# EAGLE schematic 010 (EAGLE 9.6.2)

## Sheet 1 of 4
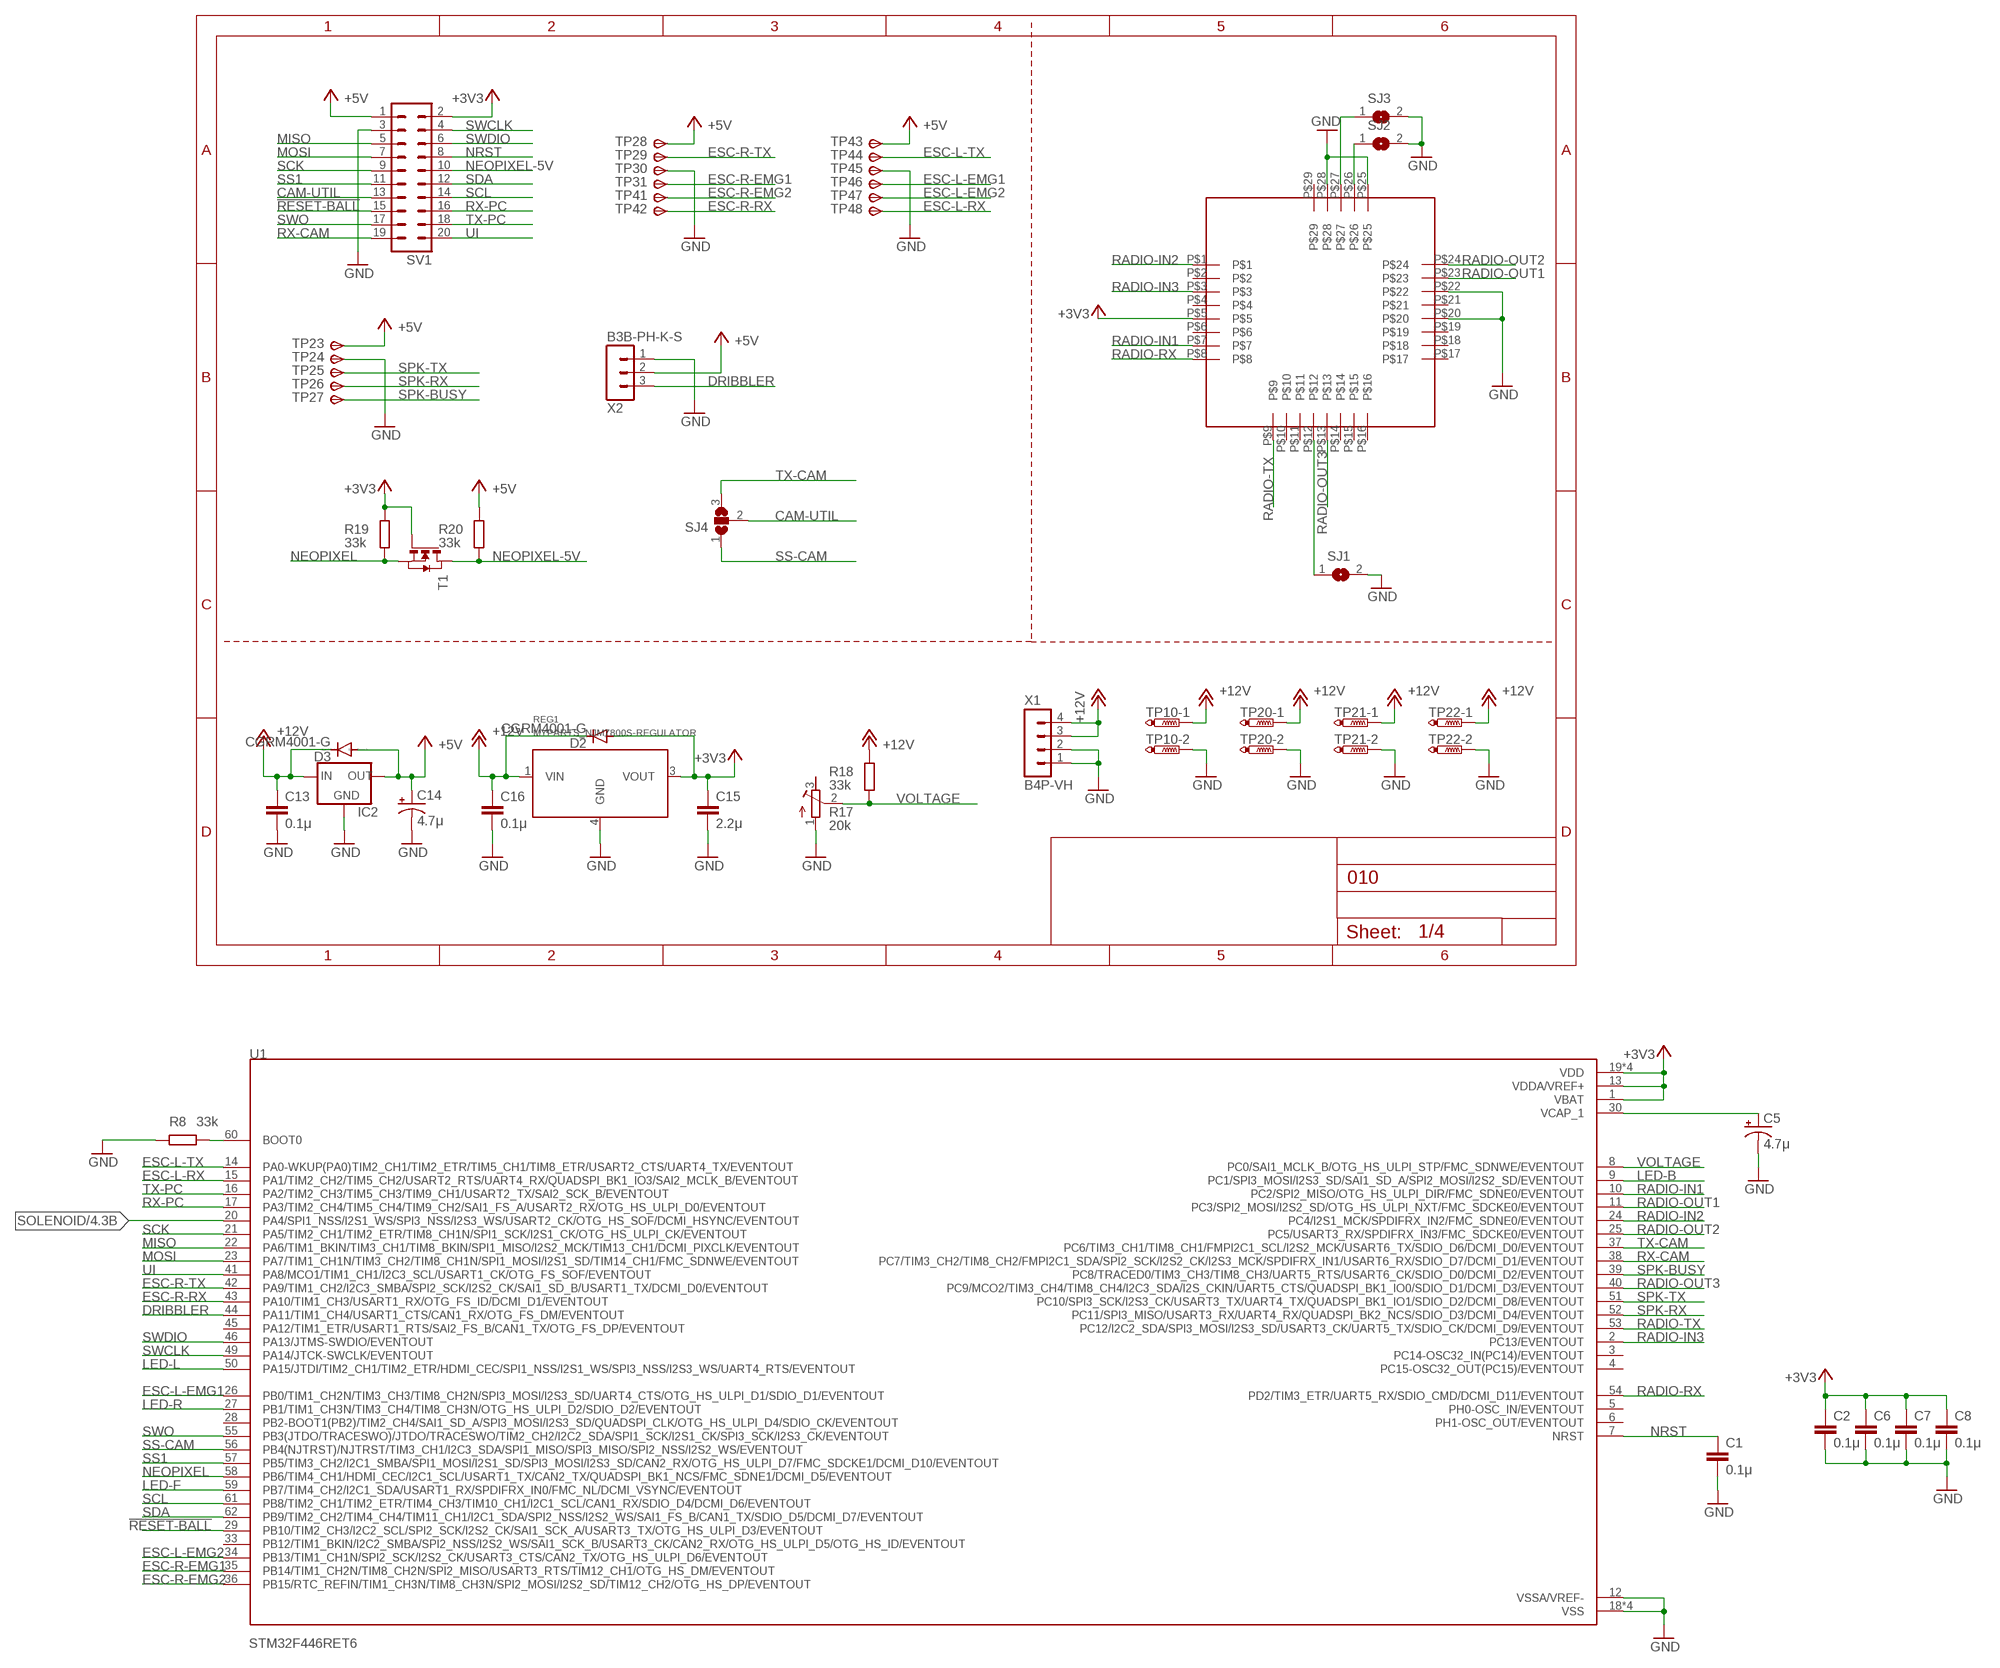
[diagram p0: schematic, sheet 1]

### Parts
C1  0.1μ  C-EUC1608  [C1608]
C2  0.1μ  C-EUC1608  [C1608]
C5  4.7μ  CPOL-USSANYO_SMD_B6  [SANYO-OSCON_SMD_B6]
C6  0.1μ  C-EUC1608  [C1608]
C7  0.1μ  C-EUC1608  [C1608]
C8  0.1μ  C-EUC1608  [C1608]
C13  0.1μ  C-EUC1608  [C1608]
C14  4.7μ  CPOL-USSANYO_SMD_B6  [SANYO-OSCON_SMD_B6]
C15  2.2μ  C-EUC1608  [C1608]
C16  0.1μ  C-EUC1608  [C1608]
D2  CGRM4001-G  [SOD-123_MINI-SMA]
D3  CGRM4001-G  [SOD-123_MINI-SMA]
IC2  78XXS  [78XXS]
R8  33k  R-EU_R0603  [R0603]
R17  20k  R-TRIMM3296W  [RTRIM3296W]
R18  33k  R-EU_R0603  [R0603]
R19  33k  R-EU_R0603  [R0603]
R20  33k  R-EU_R0603  [R0603]
REG1  MYPARTS_NJM7800S-REGULATOR  [MYPARTS_D-PAK_TO252AA]
SJ1  SJ  [SJ]
SJ2  SJ  [SJ]
SJ3  SJ  [SJ]
SJ4  SJ2W  [SJ_2]
SV1  ML20  [ML20]
T1  NMOSSOT23  [SOT-23]
TP10  PTR2  [P2-38-17]
TP20  PTR2  [P2-38-17]
TP21  PTR2  [P2-38-17]
TP22  PTR2  [P2-38-17]
TP23  TPSTP09SQ  [TP09SQ]
TP24  TPSTP09R  [TP09R]
TP25  TPSTP09R  [TP09R]
TP26  TPSTP09R  [TP09R]
TP27  TPSTP09R  [TP09R]
TP28  TPSTP09SQ  [TP09SQ]
TP29  TPSTP09R  [TP09R]
TP30  TPSTP09R  [TP09R]
TP31  TPSTP09R  [TP09R]
TP41  TPSTP09R  [TP09R]
TP42  TPSTP09R  [TP09R]
TP43  TPSTP09SQ  [TP09SQ]
TP44  TPSTP09R  [TP09R]
TP45  TPSTP09R  [TP09R]
TP46  TPSTP09R  [TP09R]
TP47  TPSTP09R  [TP09R]
TP48  TPSTP09R  [TP09R]
U1  STM32F446RET6  [QFP50P1200X1200X160-64N]
U$1  LITE  [LITE]
X1  B4P-VH  [B4P-VH]
X2  B3B-PH-K-S  [B3B-PH-K-S]

### Nets
!RESET-BALL: SV1.15 U1.29(PB10/TIM2_CH3/I2C2_SCL/SPI2_SCK/I2S2_CK/SAI1_SCK_A/USART3_TX/OTG_HS_ULPI_D3/EVENTOUT)
+3V3: C2.1 C6.1 C7.1 C8.1 C15.1 D2.A R19.2 REG1.3(VOUT) SV1.2 T1.3(G) U1.1(VBAT) U1.13(VDDA/VREF+) U1.19(VDD) U1.32(VDD) U1.48(VDD) U1.64(VDD) U$1.P$5 ; also sheet 2,3
+5V: C14.+ D3.A IC2.OUT R20.2 SV1.1 TP23.TP(PP) TP28.TP(PP) TP43.TP(PP) X2.2 ; also sheet 2,3
+12V: C13.1 C16.1 D2.C D3.C IC2.IN R18.2 REG1.1(VIN) TP10.TP-1 TP20.TP-1 TP21.TP-1 TP22.TP-1 X1.3 X1.4 ; also sheet 4
CAM-UTIL: SJ4.2 SV1.13
DRIBBLER: U1.44(PA11/TIM1_CH4/USART1_CTS/CAN1_RX/OTG_FS_DM/EVENTOUT) X2.3
ESC-L-EMG1: TP46.TP(PP) U1.26(PB0/TIM1_CH2N/TIM3_CH3/TIM8_CH2N/SPI3_MOSI/I2S3_SD/UART4_CTS/OTG_HS_ULPI_D1/SDIO_D1/EVENTOUT)
ESC-L-EMG2: TP47.TP(PP) U1.34(PB13/TIM1_CH1N/SPI2_SCK/I2S2_CK/USART3_CTS/CAN2_TX/OTG_HS_ULPI_D6/EVENTOUT)
ESC-L-RX: TP48.TP(PP) U1.15(PA1/TIM2_CH2/TIM5_CH2/USART2_RTS/UART4_RX/QUADSPI_BK1_IO3/SAI2_MCLK_B/EVENTOUT)
ESC-L-TX: TP44.TP(PP) U1.14(PA0-WKUP(PA0)TIM2_CH1/TIM2_ETR/TIM5_CH1/TIM8_ETR/USART2_CTS/UART4_TX/EVENTOUT)
ESC-R-EMG1: TP31.TP(PP) U1.35(PB14/TIM1_CH2N/TIM8_CH2N/SPI2_MISO/USART3_RTS/TIM12_CH1/OTG_HS_DM/EVENTOUT)
ESC-R-EMG2: TP41.TP(PP) U1.36(PB15/RTC_REFIN/TIM1_CH3N/TIM8_CH3N/SPI2_MOSI/I2S2_SD/TIM12_CH2/OTG_HS_DP/EVENTOUT)
ESC-R-RX: TP42.TP(PP) U1.43(PA10/TIM1_CH3/USART1_RX/OTG_FS_ID/DCMI_D1/EVENTOUT)
ESC-R-TX: TP29.TP(PP) U1.42(PA9/TIM1_CH2/I2C3_SMBA/SPI2_SCK/I2S2_CK/SAI1_SD_B/USART1_TX/DCMI_D0/EVENTOUT)
GND: C1.2 C2.2 C5.- C6.2 C7.2 C8.2 C13.2 C14.- C15.2 C16.2 IC2.GND R8.2 R17.1(A) REG1.4(GND) SJ1.2 SJ2.2 SJ3.2 SV1.3 TP10.TP-2 TP20.TP-2 TP21.TP-2 TP22.TP-2 TP24.TP(PP) TP30.TP(PP) TP45.TP(PP) U1.12(VSSA/VREF-) U1.18(VSS) U1.31(VSS) U1.47(VSS) U1.63(VSS) U$1.P$20 U$1.P$22 U$1.P$25 U$1.P$28 X1.1 X1.2 X2.1 ; also sheet 2,3,4
LED-B: U1.9(PC1/SPI3_MOSI/I2S3_SD/SAI1_SD_A/SPI2_MOSI/I2S2_SD/EVENTOUT) ; also sheet 3
LED-F: U1.59(PB7/TIM4_CH2/I2C1_SDA/USART1_RX/SPDIFRX_IN0/FMC_NL/DCMI_VSYNC/EVENTOUT) ; also sheet 3
LED-L: U1.50(PA15/JTDI/TIM2_CH1/TIM2_ETR/HDMI_CEC/SPI1_NSS/I2S1_WS/SPI3_NSS/I2S3_WS/UART4_RTS/EVENTOUT) ; also sheet 2
LED-R: U1.27(PB1/TIM1_CH3N/TIM3_CH4/TIM8_CH3N/OTG_HS_ULPI_D2/SDIO_D2/EVENTOUT) ; also sheet 2
MISO: SV1.5 U1.22(PA6/TIM1_BKIN/TIM3_CH1/TIM8_BKIN/SPI1_MISO/I2S2_MCK/TIM13_CH1/DCMI_PIXCLK/EVENTOUT)
MOSI: SV1.7 U1.23(PA7/TIM1_CH1N/TIM3_CH2/TIM8_CH1N/SPI1_MOSI/I2S1_SD/TIM14_CH1/FMC_SDNWE/EVENTOUT)
N$4: R8.1 U1.60(BOOT0)
N$5: C5.+ U1.30(VCAP_1)
N$6: SJ1.1 U$1.P$12
N$7: SJ2.1 U$1.P$26
N$8: SJ3.1 U$1.P$27
NEOPIXEL: R19.1 T1.2(S) U1.58(PB6/TIM4_CH1/HDMI_CEC/I2C1_SCL/USART1_TX/CAN2_TX/QUADSPI_BK1_NCS/FMC_SDNE1/DCMI_D5/EVENTOUT)
NEOPIXEL-5V: R20.1 SV1.10 T1.1(D)
NRST: C1.1 SV1.8 U1.7(NRST)
RADIO-IN1: U1.10(PC2/SPI2_MISO/OTG_HS_ULPI_DIR/FMC_SDNE0/EVENTOUT) U$1.P$7
RADIO-IN2: U1.24(PC4/I2S1_MCK/SPDIFRX_IN2/FMC_SDNE0/EVENTOUT) U$1.P$1
RADIO-IN3: U1.2(PC13/EVENTOUT) U$1.P$3
RADIO-OUT1: U1.11(PC3/SPI2_MOSI/I2S2_SD/OTG_HS_ULPI_NXT/FMC_SDCKE0/EVENTOUT) U$1.P$23
RADIO-OUT2: U1.25(PC5/USART3_RX/SPDIFRX_IN3/FMC_SDCKE0/EVENTOUT) U$1.P$24
RADIO-OUT3: U1.40(PC9/MCO2/TIM3_CH4/TIM8_CH4/I2C3_SDA/I2S_CKIN/UART5_CTS/QUADSPI_BK1_IO0/SDIO_D1/DCMI_D3/EVENTOUT) U$1.P$13
RADIO-RX: U1.54(PD2/TIM3_ETR/UART5_RX/SDIO_CMD/DCMI_D11/EVENTOUT) U$1.P$8
RADIO-TX: U1.53(PC12/I2C2_SDA/SPI3_MOSI/I2S3_SD/USART3_CK/UART5_TX/SDIO_CK/DCMI_D9/EVENTOUT) U$1.P$9
RX-CAM: SV1.19 U1.38(PC7/TIM3_CH2/TIM8_CH2/FMPI2C1_SDA/SPI2_SCK/I2S2_CK/I2S3_MCK/SPDIFRX_IN1/USART6_RX/SDIO_D7/DCMI_D1/EVENTOUT)
RX-PC: SV1.16 U1.17(PA3/TIM2_CH4/TIM5_CH4/TIM9_CH2/SAI1_FS_A/USART2_RX/OTG_HS_ULPI_D0/EVENTOUT)
SCK: SV1.9 U1.21(PA5/TIM2_CH1/TIM2_ETR/TIM8_CH1N/SPI1_SCK/I2S1_CK/OTG_HS_ULPI_CK/EVENTOUT)
SCL: SV1.14 U1.61(PB8/TIM2_CH1/TIM2_ETR/TIM4_CH3/TIM10_CH1/I2C1_SCL/CAN1_RX/SDIO_D4/DCMI_D6/EVENTOUT) ; also sheet 2,3
SDA: SV1.12 U1.62(PB9/TIM2_CH2/TIM4_CH4/TIM11_CH1/I2C1_SDA/SPI2_NSS/I2S2_WS/SAI1_FS_B/CAN1_TX/SDIO_D5/DCMI_D7/EVENTOUT) ; also sheet 2,3
SOLENOID: U1.20(PA4/SPI1_NSS/I2S1_WS/SPI3_NSS/I2S3_WS/USART2_CK/OTG_HS_SOF/DCMI_HSYNC/EVENTOUT) ; also sheet 4
SPK-BUSY: TP27.TP(PP) U1.39(PC8/TRACED0/TIM3_CH3/TIM8_CH3/UART5_RTS/USART6_CK/SDIO_D0/DCMI_D2/EVENTOUT)
SPK-RX: TP26.TP(PP) U1.52(PC11/SPI3_MISO/USART3_RX/UART4_RX/QUADSPI_BK2_NCS/SDIO_D3/DCMI_D4/EVENTOUT)
SPK-TX: TP25.TP(PP) U1.51(PC10/SPI3_SCK/I2S3_CK/USART3_TX/UART4_TX/QUADSPI_BK1_IO1/SDIO_D2/DCMI_D8/EVENTOUT)
SS1: SV1.11 U1.57(PB5/TIM3_CH2/I2C1_SMBA/SPI1_MOSI/I2S1_SD/SPI3_MOSI/I2S3_SD/CAN2_RX/OTG_HS_ULPI_D7/FMC_SDCKE1/DCMI_D10/EVENTOUT)
SS-CAM: SJ4.1 U1.56(PB4(NJTRST)/NJTRST/TIM3_CH1/I2C3_SDA/SPI1_MISO/SPI3_MISO/SPI2_NSS/I2S2_WS/EVENTOUT)
SWCLK: SV1.4 U1.49(PA14/JTCK-SWCLK/EVENTOUT)
SWDIO: SV1.6 U1.46(PA13/JTMS-SWDIO/EVENTOUT)
SWO: SV1.17 U1.55(PB3(JTDO/TRACESWO)/JTDO/TRACESWO/TIM2_CH2/I2C2_SDA/SPI1_SCK/I2S1_CK/SPI3_SCK/I2S3_CK/EVENTOUT)
TX-CAM: SJ4.3 U1.37(PC6/TIM3_CH1/TIM8_CH1/FMPI2C1_SCL/I2S2_MCK/USART6_TX/SDIO_D6/DCMI_D0/EVENTOUT)
TX-PC: SV1.18 U1.16(PA2/TIM2_CH3/TIM5_CH3/TIM9_CH1/USART2_TX/SAI2_SCK_B/EVENTOUT)
UI: SV1.20 U1.41(PA8/MCO1/TIM1_CH1/I2C3_SCL/USART1_CK/OTG_FS_SOF/EVENTOUT)
VOLTAGE: R17.2(S) R18.1 U1.8(PC0/SAI1_MCLK_B/OTG_HS_ULPI_STP/FMC_SDNWE/EVENTOUT)
Unconnected: R17.3(E) U1.3(PC14-OSC32_IN(PC14)/EVENTOUT) U1.4(PC15-OSC32_OUT(PC15)/EVENTOUT) U1.5(PH0-OSC_IN/EVENTOUT) U1.6(PH1-OSC_OUT/EVENTOUT) U1.28(PB2-BOOT1(PB2)/TIM2_CH4/SAI1_SD_A/SPI3_MOSI/I2S3_SD/QUADSPI_CLK/OTG_HS_ULPI_D4/SDIO_CK/EVENTOUT) U1.33(PB12/TIM1_BKIN/I2C2_SMBA/SPI2_NSS/I2S2_WS/SAI1_SCK_B/USART3_CK/CAN2_RX/OTG_HS_ULPI_D5/OTG_HS_ID/EVENTOUT) U1.45(PA12/TIM1_ETR/USART1_RTS/SAI2_FS_B/CAN1_TX/OTG_FS_DP/EVENTOUT) U$1.P$2 U$1.P$4 U$1.P$6 U$1.P$10 U$1.P$11 U$1.P$14 U$1.P$15 U$1.P$16 U$1.P$17 U$1.P$18 U$1.P$19 U$1.P$21 U$1.P$29

## Sheet 2 of 4
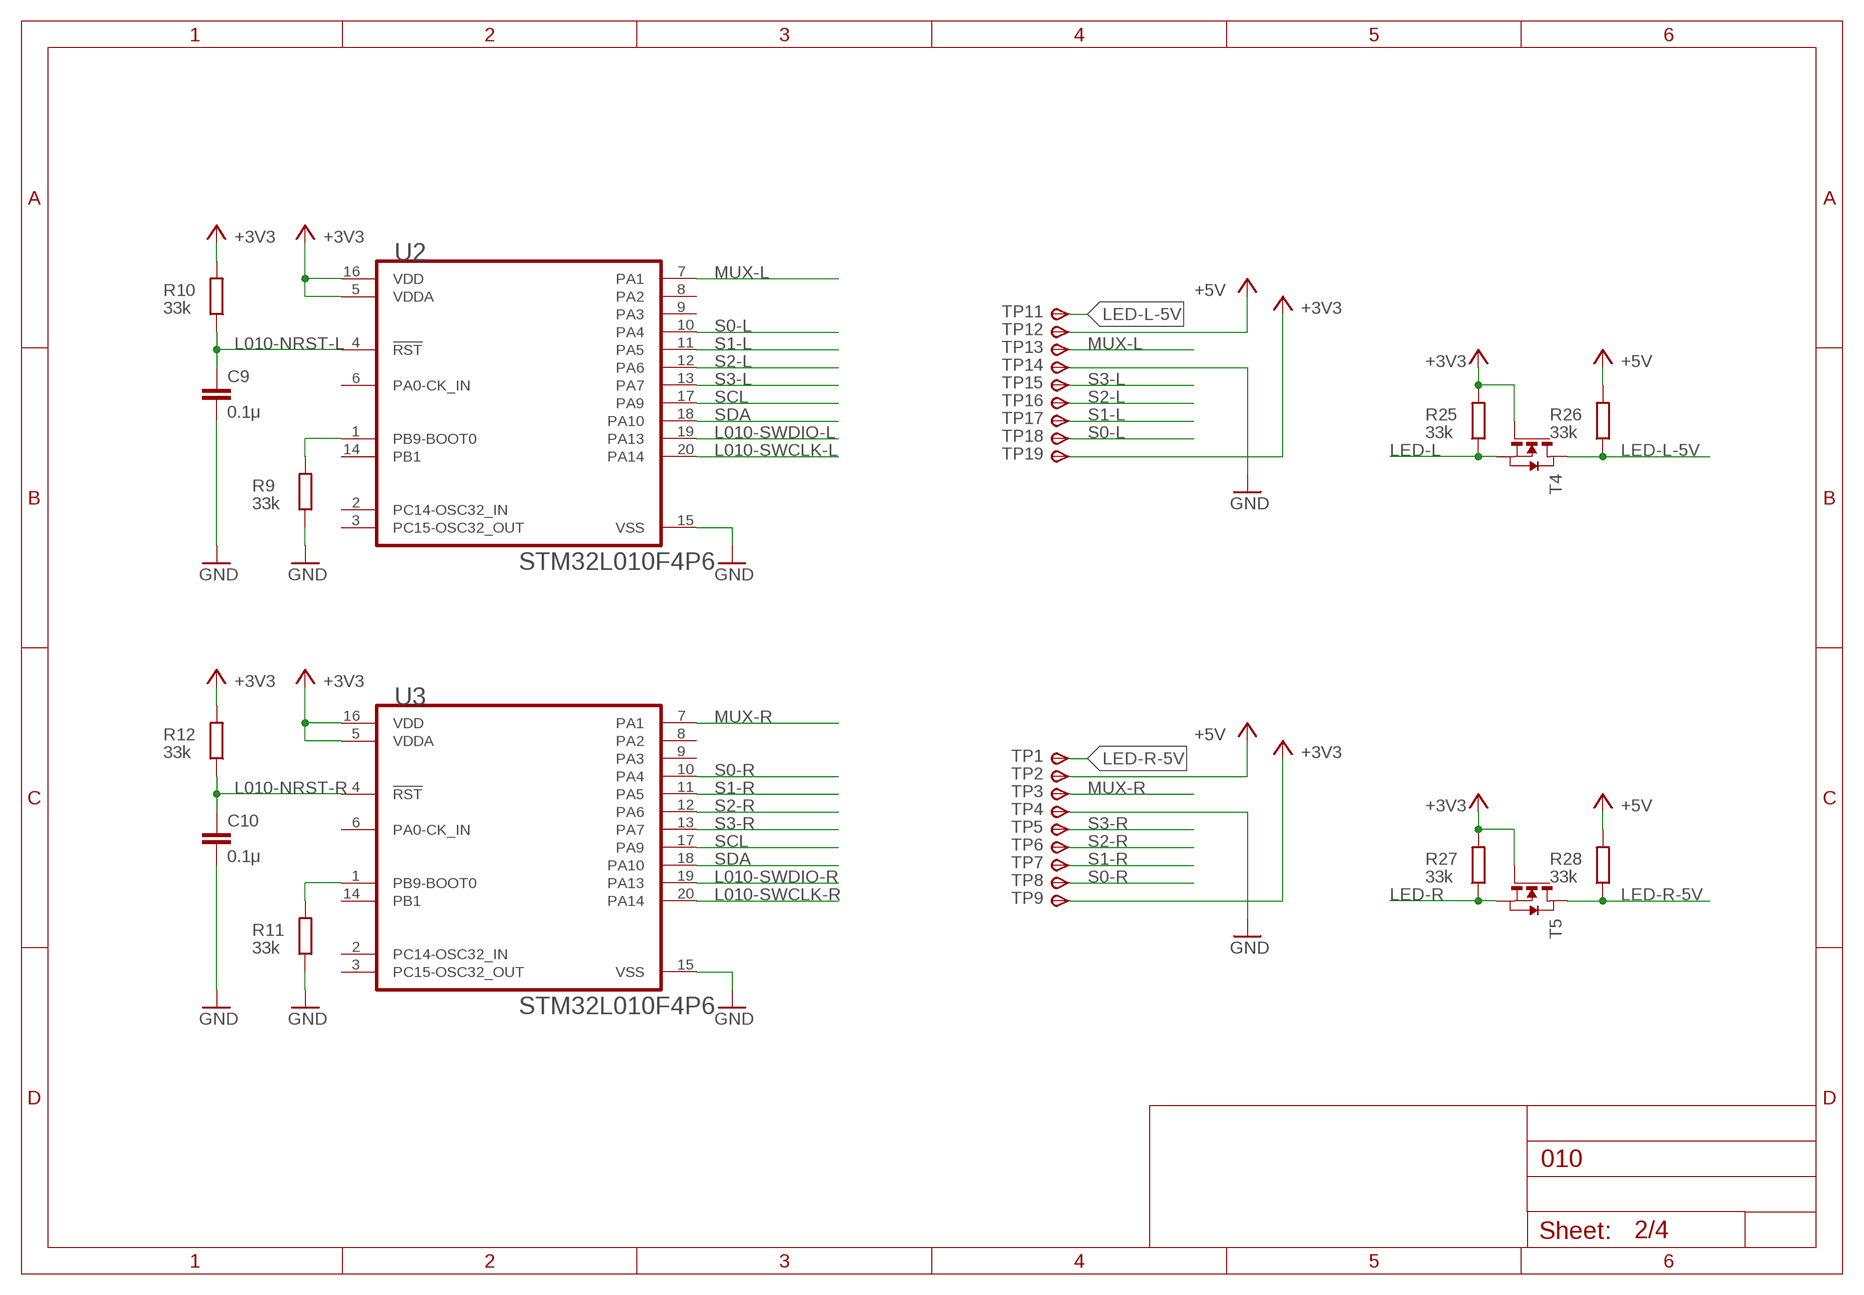
[diagram p1: schematic, sheet 2]

### Parts
C9  0.1μ  C-EUC1608  [C1608]
C10  0.1μ  C-EUC1608  [C1608]
R9  33k  R-EU_R0603  [R0603]
R10  33k  R-EU_R0603  [R0603]
R11  33k  R-EU_R0603  [R0603]
R12  33k  R-EU_R0603  [R0603]
R25  33k  R-EU_R0603  [R0603]
R26  33k  R-EU_R0603  [R0603]
R27  33k  R-EU_R0603  [R0603]
R28  33k  R-EU_R0603  [R0603]
T4  NMOSSOT23  [SOT-23]
T5  NMOSSOT23  [SOT-23]
TP1  TPSTP09SQ  [TP09SQ]
TP2  TPSTP09R  [TP09R]
TP3  TPSTP09R  [TP09R]
TP4  TPSTP09R  [TP09R]
TP5  TPSTP09R  [TP09R]
TP6  TPSTP09R  [TP09R]
TP7  TPSTP09R  [TP09R]
TP8  TPSTP09R  [TP09R]
TP9  TPSTP09R  [TP09R]
TP11  TPSTP09SQ  [TP09SQ]
TP12  TPSTP09R  [TP09R]
TP13  TPSTP09R  [TP09R]
TP14  TPSTP09R  [TP09R]
TP15  TPSTP09R  [TP09R]
TP16  TPSTP09R  [TP09R]
TP17  TPSTP09R  [TP09R]
TP18  TPSTP09R  [TP09R]
TP19  TPSTP09R  [TP09R]
U2  STMICROELECTRONICS_STM32L010F4P6STMICROELECTRONICS_STM32L010F4P6_0_2  [STMICROELECTRONICS_STM32L010F4P6_2]
U3  STMICROELECTRONICS_STM32L010F4P6STMICROELECTRONICS_STM32L010F4P6_0_2  [STMICROELECTRONICS_STM32L010F4P6_2]

### Nets
+3V3: R10.2 R12.2 R25.2 R27.2 T4.3(G) T5.3(G) TP9.TP(PP) TP19.TP(PP) U2.5(VDDA) U2.16(VDD) U3.5(VDDA) U3.16(VDD) ; also sheet 1,3
+5V: R26.2 R28.2 TP2.TP(PP) TP12.TP(PP) ; also sheet 1,3
GND: C9.2 C10.2 R9.1 R11.1 TP4.TP(PP) TP14.TP(PP) U2.15(VSS) U3.15(VSS) ; also sheet 1,3,4
L010-NRST-L: C9.1 R10.1 U2.4(!RST!)
L010-NRST-R: C10.1 R12.1 U3.4(!RST!)
L010-SWCLK-L: U2.20(PA14)
L010-SWCLK-R: U3.20(PA14)
L010-SWDIO-L: U2.19(PA13)
L010-SWDIO-R: U3.19(PA13)
LED-L: R25.1 T4.2(S) ; also sheet 1
LED-L-5V: R26.1 T4.1(D) TP11.TP(PP)
LED-R: R27.1 T5.2(S) ; also sheet 1
LED-R-5V: R28.1 T5.1(D) TP1.TP(PP)
MUX-L: TP13.TP(PP) U2.7(PA1)
MUX-R: TP3.TP(PP) U3.7(PA1)
N$9: R11.2 U3.1(PB9-BOOT0)
N$14: R9.2 U2.1(PB9-BOOT0)
S0-L: TP18.TP(PP) U2.10(PA4)
S0-R: TP8.TP(PP) U3.10(PA4)
S1-L: TP17.TP(PP) U2.11(PA5)
S1-R: TP7.TP(PP) U3.11(PA5)
S2-L: TP16.TP(PP) U2.12(PA6)
S2-R: TP6.TP(PP) U3.12(PA6)
S3-L: TP15.TP(PP) U2.13(PA7)
S3-R: TP5.TP(PP) U3.13(PA7)
SCL: U2.17(PA9) U3.17(PA9) ; also sheet 1,3
SDA: U2.18(PA10) U3.18(PA10) ; also sheet 1,3
Unconnected: U2.2(PC14-OSC32_IN) U2.3(PC15-OSC32_OUT) U2.6(PA0-CK_IN) U2.8(PA2) U2.9(PA3) U2.14(PB1) U3.2(PC14-OSC32_IN) U3.3(PC15-OSC32_OUT) U3.6(PA0-CK_IN) U3.8(PA2) U3.9(PA3) U3.14(PB1)

## Sheet 3 of 4
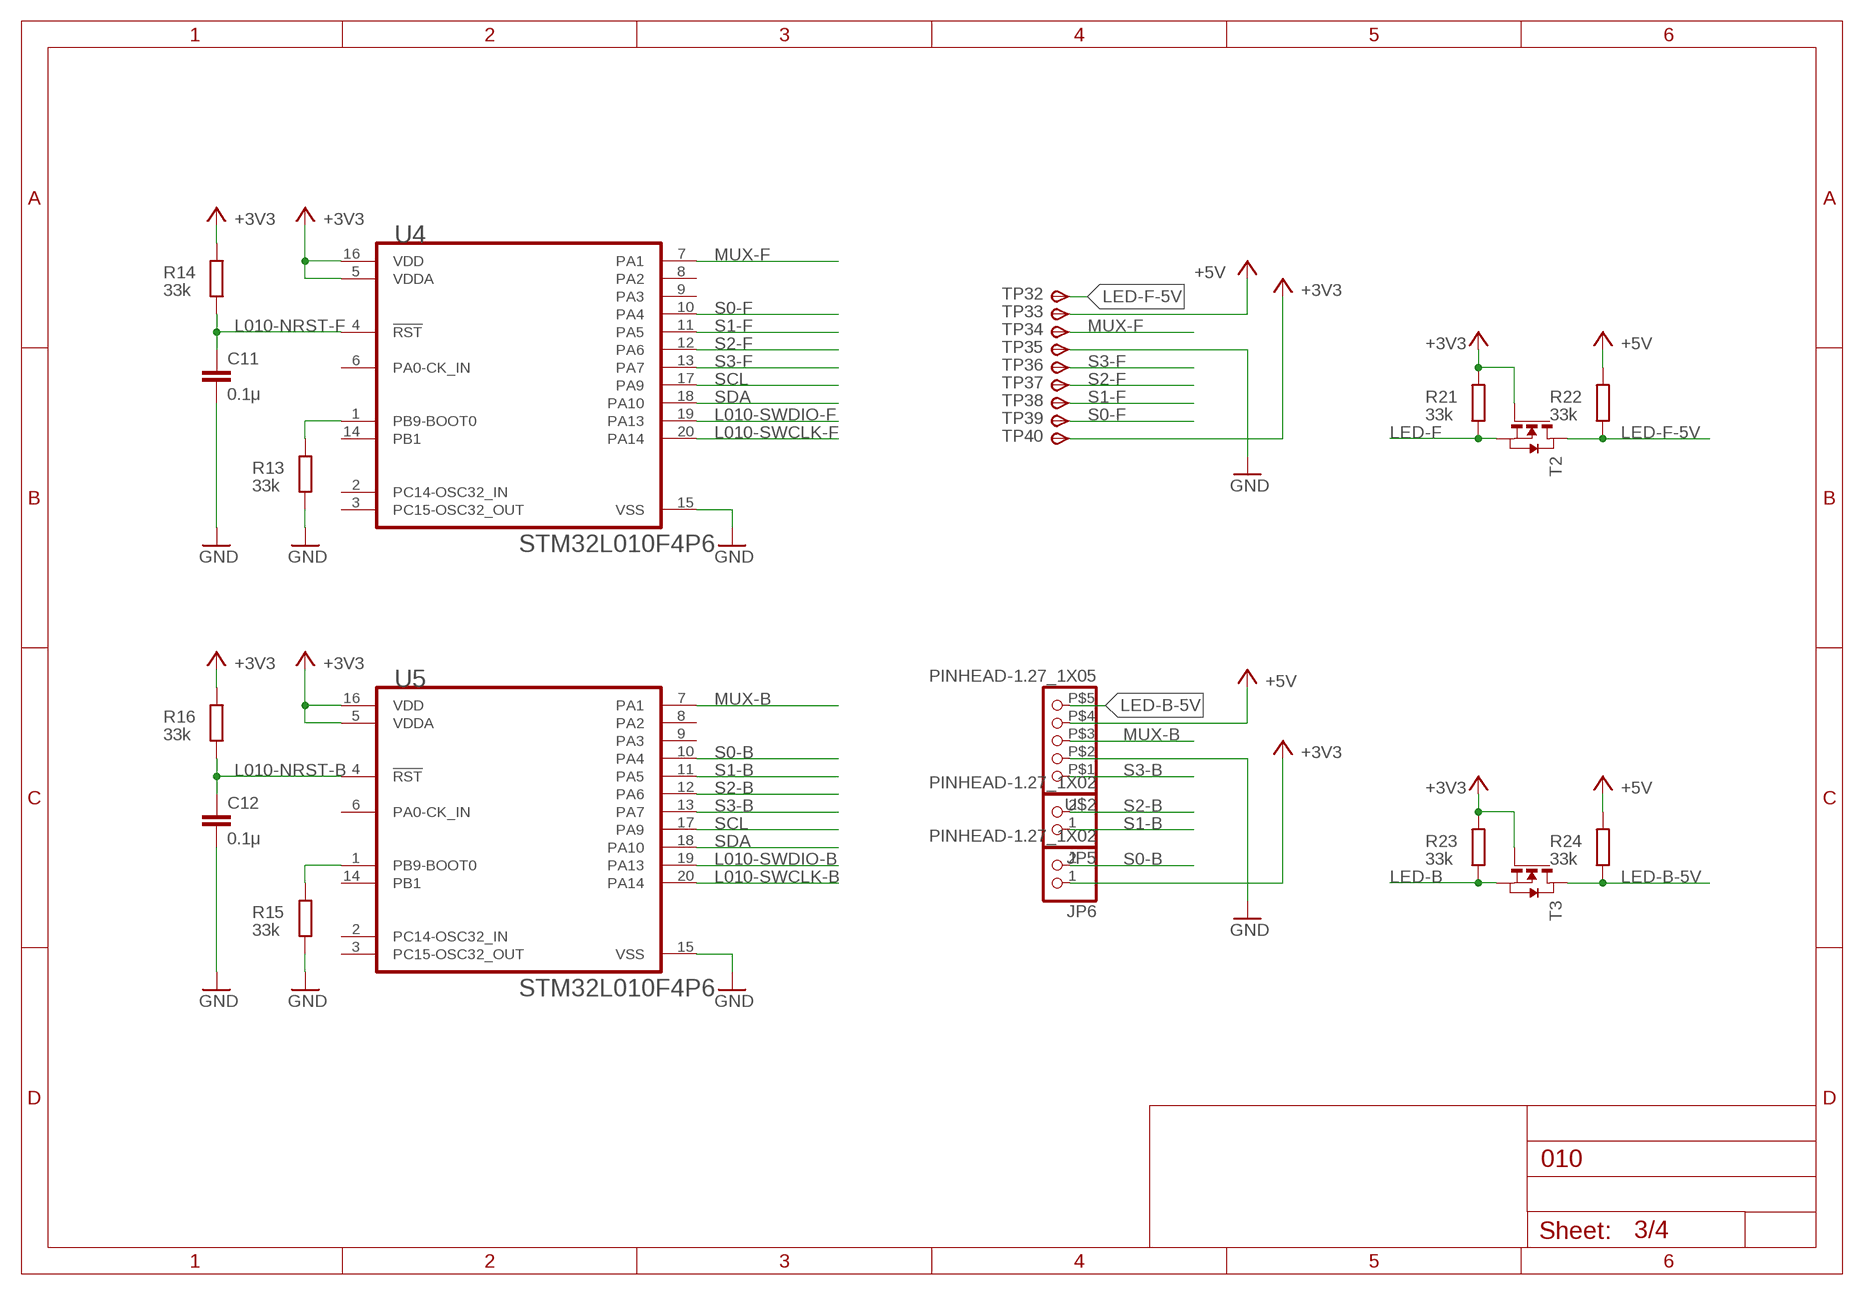
[diagram p2: schematic, sheet 3]

### Parts
C11  0.1μ  C-EUC1608  [C1608]
C12  0.1μ  C-EUC1608  [C1608]
JP5  PINHEAD-1.27_1X02  [PINHEAD-1.27_1X02]
JP6  PINHEAD-1.27_1X02  [PINHEAD-1.27_1X02]
R13  33k  R-EU_R0603  [R0603]
R14  33k  R-EU_R0603  [R0603]
R15  33k  R-EU_R0603  [R0603]
R16  33k  R-EU_R0603  [R0603]
R21  33k  R-EU_R0603  [R0603]
R22  33k  R-EU_R0603  [R0603]
R23  33k  R-EU_R0603  [R0603]
R24  33k  R-EU_R0603  [R0603]
T2  NMOSSOT23  [SOT-23]
T3  NMOSSOT23  [SOT-23]
TP32  TPSTP09SQ  [TP09SQ]
TP33  TPSTP09R  [TP09R]
TP34  TPSTP09R  [TP09R]
TP35  TPSTP09R  [TP09R]
TP36  TPSTP09R  [TP09R]
TP37  TPSTP09R  [TP09R]
TP38  TPSTP09R  [TP09R]
TP39  TPSTP09R  [TP09R]
TP40  TPSTP09R  [TP09R]
U4  STMICROELECTRONICS_STM32L010F4P6STMICROELECTRONICS_STM32L010F4P6_0_2  [STMICROELECTRONICS_STM32L010F4P6_2]
U5  STMICROELECTRONICS_STM32L010F4P6STMICROELECTRONICS_STM32L010F4P6_0_2  [STMICROELECTRONICS_STM32L010F4P6_2]
U$2  PINHEAD-1.27_1X05  [PINHEAD-1.27_1X05]

### Nets
+3V3: JP6.1 R14.2 R16.2 R21.2 R23.2 T2.3(G) T3.3(G) TP40.TP(PP) U4.5(VDDA) U4.16(VDD) U5.5(VDDA) U5.16(VDD) ; also sheet 1,2
+5V: R22.2 R24.2 TP33.TP(PP) U$2.P$4 ; also sheet 1,2
GND: C11.2 C12.2 R13.1 R15.1 TP35.TP(PP) U4.15(VSS) U5.15(VSS) U$2.P$2 ; also sheet 1,2,4
L010-NRST-B: C12.1 R16.1 U5.4(!RST!)
L010-NRST-F: C11.1 R14.1 U4.4(!RST!)
L010-SWCLK-B: U5.20(PA14)
L010-SWCLK-F: U4.20(PA14)
L010-SWDIO-B: U5.19(PA13)
L010-SWDIO-F: U4.19(PA13)
LED-B: R23.1 T3.2(S) ; also sheet 1
LED-B-5V: R24.1 T3.1(D) U$2.P$5
LED-F: R21.1 T2.2(S) ; also sheet 1
LED-F-5V: R22.1 T2.1(D) TP32.TP(PP)
MUX-B: U5.7(PA1) U$2.P$3
MUX-F: TP34.TP(PP) U4.7(PA1)
N$10: R13.2 U4.1(PB9-BOOT0)
N$11: R15.2 U5.1(PB9-BOOT0)
S0-B: JP6.2 U5.10(PA4)
S0-F: TP39.TP(PP) U4.10(PA4)
S1-B: JP5.1 U5.11(PA5)
S1-F: TP38.TP(PP) U4.11(PA5)
S2-B: JP5.2 U5.12(PA6)
S2-F: TP37.TP(PP) U4.12(PA6)
S3-B: U5.13(PA7) U$2.P$1
S3-F: TP36.TP(PP) U4.13(PA7)
SCL: U4.17(PA9) U5.17(PA9) ; also sheet 1,2
SDA: U4.18(PA10) U5.18(PA10) ; also sheet 1,2
Unconnected: U4.2(PC14-OSC32_IN) U4.3(PC15-OSC32_OUT) U4.6(PA0-CK_IN) U4.8(PA2) U4.9(PA3) U4.14(PB1) U5.2(PC14-OSC32_IN) U5.3(PC15-OSC32_OUT) U5.6(PA0-CK_IN) U5.8(PA2) U5.9(PA3) U5.14(PB1)

## Sheet 4 of 4: 昇圧回路
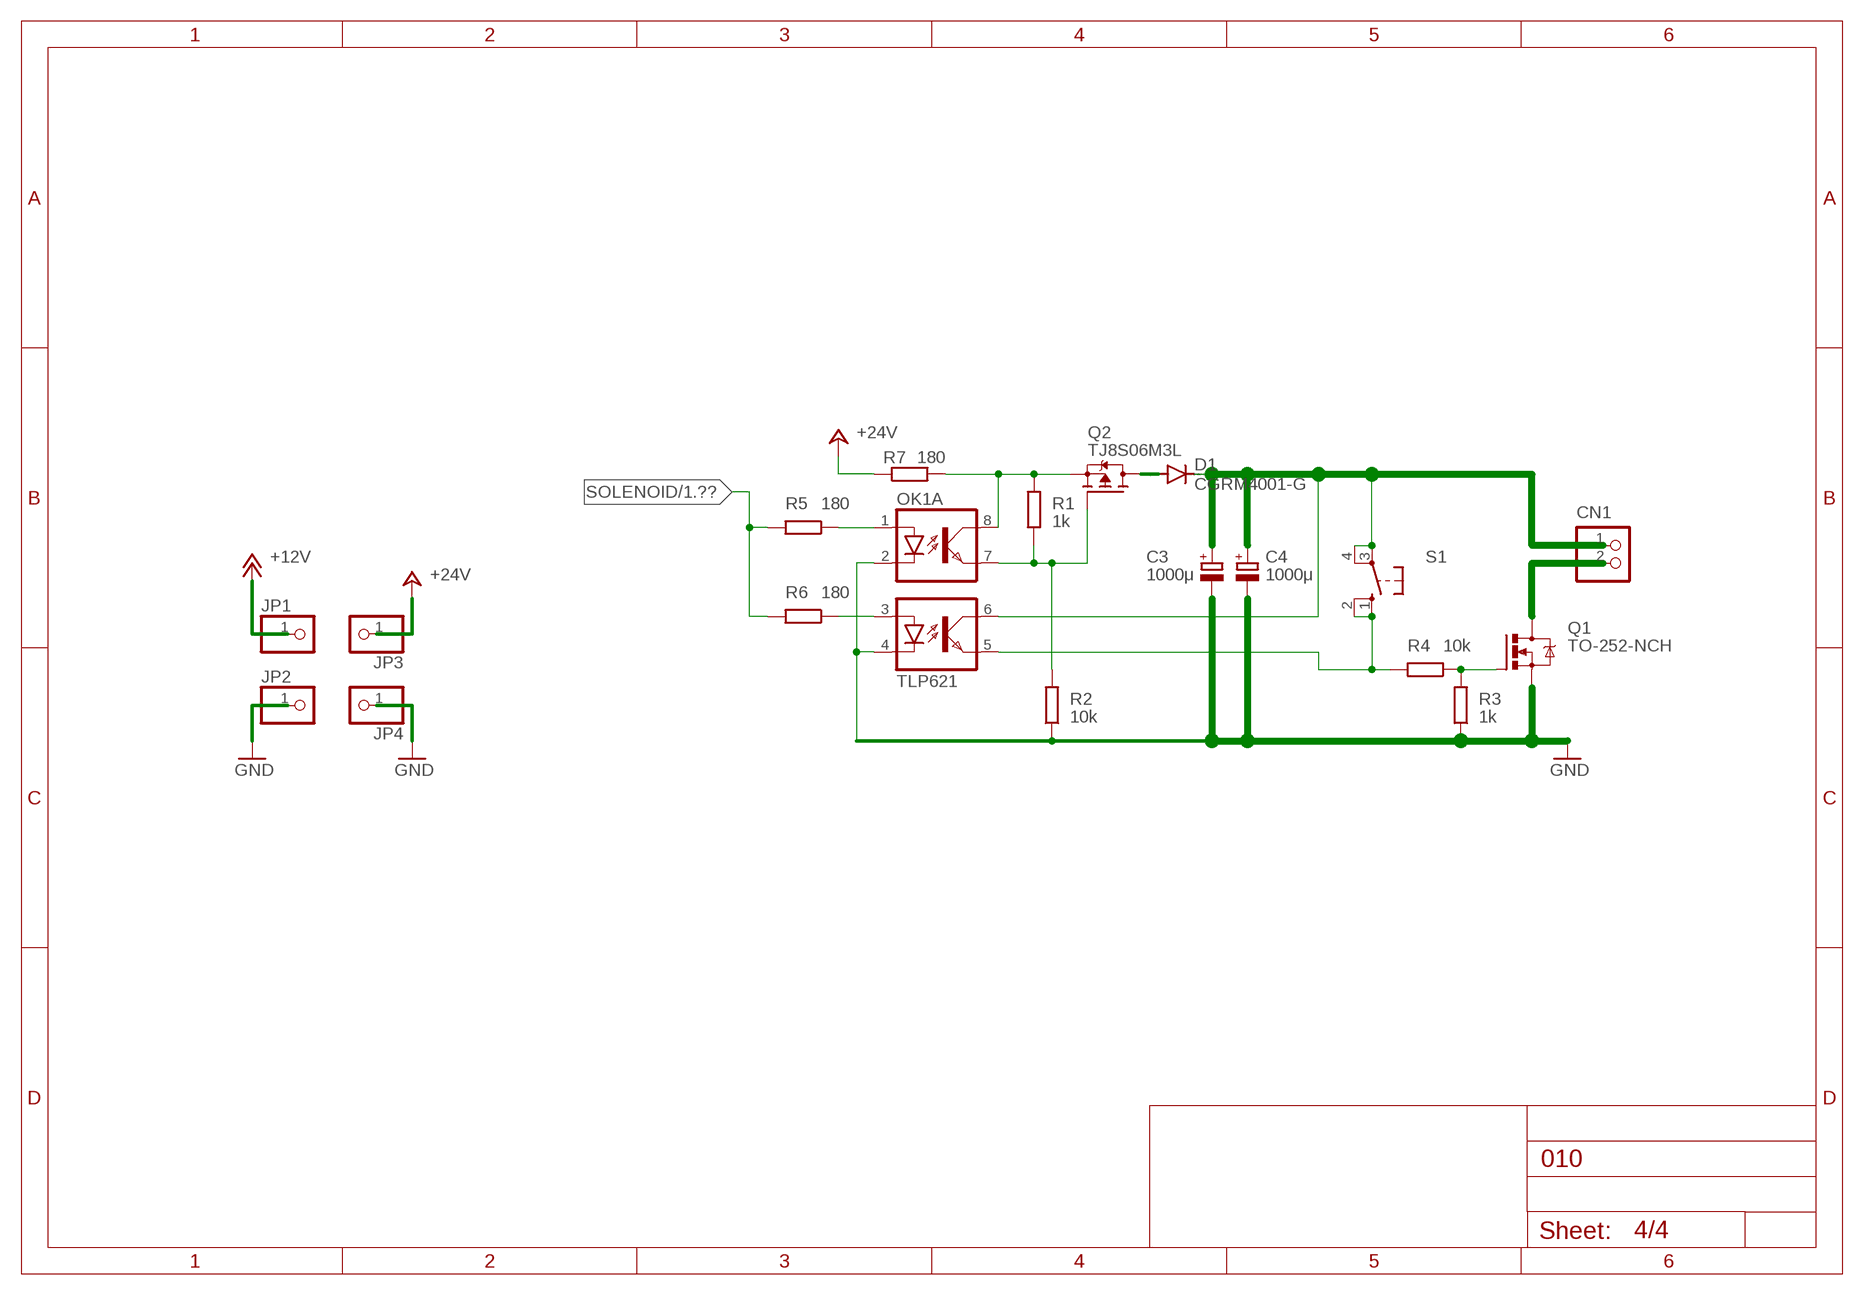
[diagram p3: schematic, sheet 4]

### Parts
C3  1000μ  C12.5  [C12.5]
C4  1000μ  C12.5  [C12.5]
CN1  B2B-PH-K-S  [B2B-PH-K-S]
D1  CGRM4001-G  [SOD-123_MINI-SMA]
JP1  PINHD-1X1  [1X01]
JP2  PINHD-1X1  [1X01]
JP3  PINHD-1X1  [1X01]
JP4  PINHD-1X1  [1X01]
OK1  TLP621  PC827  [DIL08]
Q1  TO-252-NCH  [D-PAK_TO252AA]
Q2  TJ8S06M3L  SPD30P06PTO252  [TO252]
R1  1k  R-EU_R0603  [R0603]
R2  10k  R-EU_R0603  [R0603]
R3  1k  R-EU_R0603  [R0603]
R4  10k  R-EU_R0603  [R0603]
R5  180  R-EU_R0603  [R0603]
R6  180  R-EU_R0603  [R0603]
R7  180  R-EU_0204/7  [0204/7]
S1  10-XX  [B3F-10XX]

### Nets
+12V: JP1.1 ; also sheet 1
+24V: JP3.1 R7.1
GND: C3.P$1(-) C4.P$1(-) JP2.1 JP4.1 OK1.2(A:C) OK1.4(B:C) Q1.3(S) R2.1 R3.1 ; also sheet 1,2,3
N$1: OK1.3(B:A) R6.1
N$2: OK1.1(A:A) R5.1
N$3: OK1.8(A:COL) Q2.2(S) R1.2 R7.2
N$12: D1.A Q2.3(D)
N$13: OK1.7(A:EMIT) Q2.1(G) R1.1 R2.2
N$16: C3.P$2(+) C4.P$2(+) CN1.1 D1.C OK1.6(B:COL) S1.3(P) S1.4(P1)
N$17: CN1.2 Q1.4(D)
N$18: Q1.1(G) R3.2 R4.1
N$19: OK1.5(B:EMIT) R4.2 S1.1(S) S1.2(S1)
SOLENOID: R5.2 R6.2 ; also sheet 1

## Library data of the parts
C1 C2 C6-C13 C15 C16 = rcl:C-EU: CAPACITOR, European symbol; SPICEPREFIX: C
C3 C4 = myParts2:C12.5
C5 C14 = rcl:CPOL-US: POLARIZED CAPACITOR, American symbol; SPICEPREFIX: C
CN1 = jst-ph:B2B-PH-*: Wire-to-Board 2.0mm pitch top mount connector Source: http://www.jst-mfg.com/product/pdf/jpn/PH.pdf http://www.jst-mfg.com/product/detail.php?series=199
D1-D3 = diode:CGRM400*-G: Molded plasitc,JEDEC SOD-123/Mini SMA Source: Comchip CGRM4001-G.pdf
IC2 = v-reg:78XXS: VOLTAGE REGULATOR
JP1-JP4 = pinhead:PINHD-1X1: PIN HEADER
JP5 JP6 = #001-line:PINHEAD-1.27_1X02
OK1 = optocoupler:PC827: SHARP OPTO COUPLER; OC_FARNELL: unknown; OC_NEWARK: unknown
Q1 = Q:TO-252-NCH
Q2 = transistor-fet:SPD30P06P: SIPMOS(R) Power-Transistor P-Channel, Enhancement mode Source: http://www.infineon.com/upload/Document/cmc_upload/documents/012/3615/SPD_U30P06P.pdf
R1-R16 R18-R28 = rcl:R-EU_: RESISTOR, European symbol; SPICEPREFIX: R
R17 = rcl:R-TRIMM: Trimm resistor; SPICEMODEL: X; SPICEPREFIXL: POT
REG1 = #001-line:MYPARTS_NJM7800S-REGULATOR
S1 = switch-omron:10-XX: OMRON SWITCH; MPN: B3F-1000; OC_FARNELL: 176432; OC_NEWARK: 36M3542
SJ1-SJ3 = jumper:SJ: SMD solder JUMPER
SJ4 = jumper:SJ2W: SMD solder JUMPER
SV1 = con-ml:ML20: HARTING; OC_FARNELL: unknown; OC_NEWARK: unknown
T1-T5 = zetex:NMOSSOT23: MOS FET; OC_FARNELL: unknown; OC_NEWARK: unknown
TP1-TP9 TP11-TP19 TP23-TP48 = testpad:TPS: TEST PIN
TP10 TP20-TP22 = testpad:PTR2: TEST PIN
U1 = STM32F446RET6:STM32F446RET6: MCU 32-Bit STM32 ARM Cortex M4 RISC 512KB Flash 2.5V/3.3V 64-Pin LQFP Tray; DESCRIPTION: ARM® Cortex®-M4 STM32F4 Microcontroller IC 32-Bit 180MHz 512KB (512K x 8) FLASH 64-LQFP (10x10); DIGI-KEY_PART_NUMBER: 497-STM32F446RET6TR-ND; MF: STMicroelectronics; MP: STM32F446RET6; PACKAGE: LQFP-64 STMicroelectronics; PURCHASE-URL: https://pricing.snapeda.com/search/part/STM32F446RET6/?ref=eda
U2-U5 = STMicroelectronics - STM32L010F4P6:STMICROELECTRONICS_STM32L010F4P6: ARM® Cortex®-M0+ STM32L0 Microcontroller IC 32-Bit 32MHz 16KB (16K x 8) FLASH 20-TSSOP; AMBIENT_TEMPERATURE_RANGE_HIGH: +85°C; AMBIENT_TEMPERATURE_RANGE_LOW: -40°C; AUTOMOTIVE: No; CENTROID_NOT_SPECIFIED: No; CORE_ARCHITECTURE: Arm Cortex-M0+; DATASHEET: https://www.st.com/resource/en/datasheet/stm32l010f4.pdf; DATA_BUS_WIDTH: 32bits; DEVICE_CLASS_L1: Integrated Circuits (ICs); DEVICE_CLASS_L2: Embedded Processors and Controllers; DEVICE_CLASS_L3: Microcontrollers; DIGIKEY_DESCRIPTION: IC 16/32-BITS MICROS; DIGIKEY_PART_NUMBER: 497-19364-ND; FOOTPRINT_PARAMETERS_1: {"fp_type":"TSSOP2","params":{"N":{"nom":20,"long name":"Number of leads","min":null,"max":null,"short name":"N","type":"count"},"A":{"nom":false,"long name":"Height","min":false,"max":1200000,"short name":"A","type":"measurement"},"A1":{"nom":false,"long name":"Package clearance","min":50000,"max":150000,"short name":"A1","type":"measurement"},"A2":{"nom":1000000,"long name":"Package height","min":800000,"max":1050000,"short name":"A2","type":"measurement"},"D":{"nom":6500000,"long name":"Package length","min":6400000,"max":6600000,"short name":"D","type":"measurement"},"E":{"nom":6400000,"long name":"Width /w leads","min":6200000,"max":6600000,"short name":"E","type":"measurement"},"E1":{"nom":4400000,"long name":"Package width","min":4300000,"max":4500000,"short name":"E1","type":"measurement"},"B":{"nom":false,"long name":"Lead width","min":190000,"max":300000,"short name":"B","type":"measurement"},"C":{"nom":false,"long name":"Lead thickness","min":90000,"max":200000,"short name":"C","type":"measurement"},"L":{"nom":600000,"long name":"Lead foot length","min":450000,"max":750000,"short name":"L","type":"measurement"},"e":{"nom":650000,"long name":"Lead pitch","min":null,"max":null,"short name":"e","type":"measurement"},"PHI":{"nom":false,"long name":"Lead angle","min":0,"max":8000000,"short name":"PHI","type":"measurement"},"HT":{"default":"No","long name":"Thermal pad","type":"multichoiceparent","short name":"HT","children":[]},"offset x":{"nom":0,"long name":"X Center offset","min":null,"max":null,"short name":"offset x","type":"measurement"},"offset y":{"nom":0,"long name":"Y Center offset","min":null,"max":null,"short name":"offset y","type":"measurement"},"LS":{"default":"Rounded rectangle","long name":"Land shape","type":"multichoice","short name":"LS"},"LS1":{"default":"Rectangle","long name":"Land shape (Pin 1)","type":"multichoice","short name":"LS1"},"solder toe":{"nom":550000,"long name":"Solder fillet (toe)","min":null,"max":null,"short name":"solder toe","type":"fixedmeasurement"},"solder heel":{"nom":450000,"long name":"Solder fillet (heel)","min":null,"max":null,"short name":"solder heel","type":"fixedmeasurement"},"solder side":{"nom":50000,"long name":"Solder fillet (side)","min":null,"max":null,"short name":"solder side","type":"fixedmeasurement"},"courtyard":{"nom":500000,"long name":"Courtyard","min":null,"max":null,"short name":"courtyard","type":"fixedmeasurement"},"SF":{"default":"A (> 0.625mm pitch)","long name":"Packing level","type":"multichoiceparent","short name":"SF","help":"http://support.upverter.com/customer/portal/articles/978783-what-is-a-footprint-packing-level","children":["solder toe","solder heel","solder side","courtyard"]}}}; FOOTPRINT_PARAMETERS_2: {"fp_type":"TSSOP2","params":{"N":{"nom":20,"long name":"Number of leads","min":null,"max":null,"short name":"N","type":"count"},"A":{"nom":false,"long name":"Height","min":false,"max":1200000,"short name":"A","type":"measurement"},"A1":{"nom":false,"long name":"Package clearance","min":50000,"max":150000,"short name":"A1","type":"measurement"},"A2":{"nom":1000000,"long name":"Package height","min":800000,"max":1050000,"short name":"A2","type":"measurement"},"D":{"nom":6500000,"long name":"Package length","min":6400000,"max":6600000,"short name":"D","type":"measurement"},"E":{"nom":6400000,"long name":"Width /w leads","min":6200000,"max":6600000,"short name":"E","type":"measurement"},"E1":{"nom":4400000,"long name":"Package width","min":4300000,"max":4500000,"short name":"E1","type":"measurement"},"B":{"nom":false,"long name":"Lead width","min":190000,"max":300000,"short name":"B","type":"measurement"},"C":{"nom":false,"long name":"Lead thickness","min":90000,"max":200000,"short name":"C","type":"measurement"},"L":{"nom":600000,"long name":"Lead foot length","min":450000,"max":750000,"short name":"L","type":"measurement"},"e":{"nom":650000,"long name":"Lead pitch","min":null,"max":null,"short name":"e","type":"measurement"},"PHI":{"nom":false,"long name":"Lead angle","min":0,"max":8000000,"short name":"PHI","type":"measurement"},"HT":{"default":"No","long name":"Thermal pad","type":"multichoiceparent","short name":"HT","children":[]},"offset x":{"nom":0,"long name":"X Center offset","min":null,"max":null,"short name":"offset x","type":"measurement"},"offset y":{"nom":0,"long name":"Y Center offset","min":null,"max":null,"short name":"offset y","type":"measurement"},"LS":{"default":"Rounded rectangle","long name":"Land shape","type":"multichoice","short name":"LS"},"LS1":{"default":"Rectangle","long name":"Land shape (Pin 1)","type":"multichoice","short name":"LS1"},"solder toe":{"nom":350000,"long name":"Solder fillet (toe)","min":null,"max":null,"short name":"solder toe","type":"fixedmeasurement"},"solder heel":{"nom":350000,"long name":"Solder fillet (heel)","min":null,"max":null,"short name":"solder heel","type":"fixedmeasurement"},"solder side":{"nom":30000,"long name":"Solder fillet (side)","min":null,"max":null,"short name":"solder side","type":"fixedmeasurement"},"courtyard":{"nom":250000,"long name":"Courtyard","min":null,"max":null,"short name":"courtyard","type":"fixedmeasurement"},"SF":{"default":"B (> 0.625mm pitch)","long name":"Packing level","type":"multichoiceparent","short name":"SF","help":"http://support.upverter.com/customer/portal/articles/978783-what-is-a-footprint-packing-level","children":["solder toe","solder heel","solder side","courtyard"]}}}; FOOTPRINT_PARAMETERS_3: {"fp_type":"TSSOP2","params":{"N":{"nom":20,"long name":"Number of leads","min":null,"max":null,"short name":"N","type":"count"},"A":{"nom":false,"long name":"Height","min":false,"max":1200000,"short name":"A","type":"measurement"},"A1":{"nom":false,"long name":"Package clearance","min":50000,"max":150000,"short name":"A1","type":"measurement"},"A2":{"nom":1000000,"long name":"Package height","min":800000,"max":1050000,"short name":"A2","type":"measurement"},"D":{"nom":6500000,"long name":"Package length","min":6400000,"max":6600000,"short name":"D","type":"measurement"},"E":{"nom":6400000,"long name":"Width /w leads","min":6200000,"max":6600000,"short name":"E","type":"measurement"},"E1":{"nom":4400000,"long name":"Package width","min":4300000,"max":4500000,"short name":"E1","type":"measurement"},"B":{"nom":false,"long name":"Lead width","min":190000,"max":300000,"short name":"B","type":"measurement"},"C":{"nom":false,"long name":"Lead thickness","min":90000,"max":200000,"short name":"C","type":"measurement"},"L":{"nom":600000,"long name":"Lead foot length","min":450000,"max":750000,"short name":"L","type":"measurement"},"e":{"nom":650000,"long name":"Lead pitch","min":null,"max":null,"short name":"e","type":"measurement"},"PHI":{"nom":false,"long name":"Lead angle","min":0,"max":8000000,"short name":"PHI","type":"measurement"},"HT":{"default":"No","long name":"Thermal pad","type":"multichoiceparent","short name":"HT","children":[]},"offset x":{"nom":0,"long name":"X Center offset","min":null,"max":null,"short name":"offset x","type":"measurement"},"offset y":{"nom":0,"long name":"Y Center offset","min":null,"max":null,"short name":"offset y","type":"measurement"},"LS":{"default":"Rounded rectangle","long name":"Land shape","type":"multichoice","short name":"LS"},"LS1":{"default":"Rectangle","long name":"Land shape (Pin 1)","type":"multichoice","short name":"LS1"},"solder toe":{"nom":150000,"long name":"Solder fillet (toe)","min":null,"max":null,"short name":"solder toe","type":"fixedmeasurement"},"solder heel":{"nom":250000,"long name":"Solder fillet (heel)","min":null,"max":null,"short name":"solder heel","type":"fixedmeasurement"},"solder side":{"nom":10000,"long name":"Solder fillet (side)","min":null,"max":null,"short name":"solder side","type":"fixedmeasurement"},"courtyard":{"nom":100000,"long name":"Courtyard","min":null,"max":null,"short name":"courtyard","type":"fixedmeasurement"},"SF":{"default":"C (> 0.625mm pitch)","long name":"Packing level","type":"multichoiceparent","short name":"SF","help":"http://support.upverter.com/customer/portal/articles/978783-what-is-a-footprint-packing-level","children":["solder toe","solder heel","solder side","courtyard"]}}}; FOOTPRINT_VARIANT_NAME_0: Recommended_Land_Pattern; FOOTPRINT_VARIANT_NAME_1: IPC_A; FOOTPRINT_VARIANT_NAME_2: IPC_B; FOOTPRINT_VARIANT_NAME_3: IPC_C; FREQUENCY: 32MHz; HEIGHT: 1.2mm; INTERFACE: I2C,SPI,UART,USART,SMBus,Other; IPC_LAND_PATTERN_NAME: SOP65P640X120-20; LEAD_FREE: Yes; MAX_JUNCTION_TEMP: +105°C; MAX_SUPPLY_VOLTAGE: 3.6V; MEMORY_SIZE: 16KBytes; MEMORY_TYPE: FLASH; MF: STMicroelectronics; MFG_PACKAGE_IDENT: TSSOP20-YA; MFG_PACKAGE_IDENT_DATE: 0; MFG_PACKAGE_IDENT_REV: 3; MIN_SUPPLY_VOLTAGE: 1.8V; MOUSER_DESCRIPTION: Cortex M0+ 16K TSSOP20 85°C; MOUSER_PART_NUMBER: 511-STM32L010F4P6; MPN: STM32L010F4P6; NUMBER_OF_A/D_CONVERTERS: 1; NUMBER_OF_ADC_CHANNELS: 7; NUMBER_OF_CORES: 1; NUMBER_OF_I/OS: 16; NUMBER_OF_I2C_CHANNELS: 1; NUMBER_OF_SPI_CHANNELS: 1; NUMBER_OF_TIMERS/COUNTERS: 7; NUMBER_OF_UART_CHANNELS: 1; PACKAGE: TSSOP20; PREFIX: U; RAM_SIZE: 2KBytes; ROHS: Yes; STANDOFF_HEIGHT: 0.05mm; TEMPERATURE_RANGE_HIGH: +105°C; TEMPERATURE_RANGE_LOW: -40°C; VERIFICATION_VERSION: 0.0.0.3
U$1 = TWELite:LITE
U$2 = #001-line:PINHEAD-1.27_1X05
X1 = con-JST VH:B4P-VH: JST VH Series header 3.96mm pitch disconnectable crimp style connectors, vertical (side entry type), 4 pins
X2 = con-JST PH:B3B-PH: JST PH series header 2.00mm pitch disconnectable crimp style connectors, vertical (side entry type), 3 pins

## Net classes
0 default: width 0.203 mm